# EAGLE schematic boardv2a (EAGLE 6.6.0), part 2 of 2
## Sheet 23 of 28: FPGA - Modular Connector E
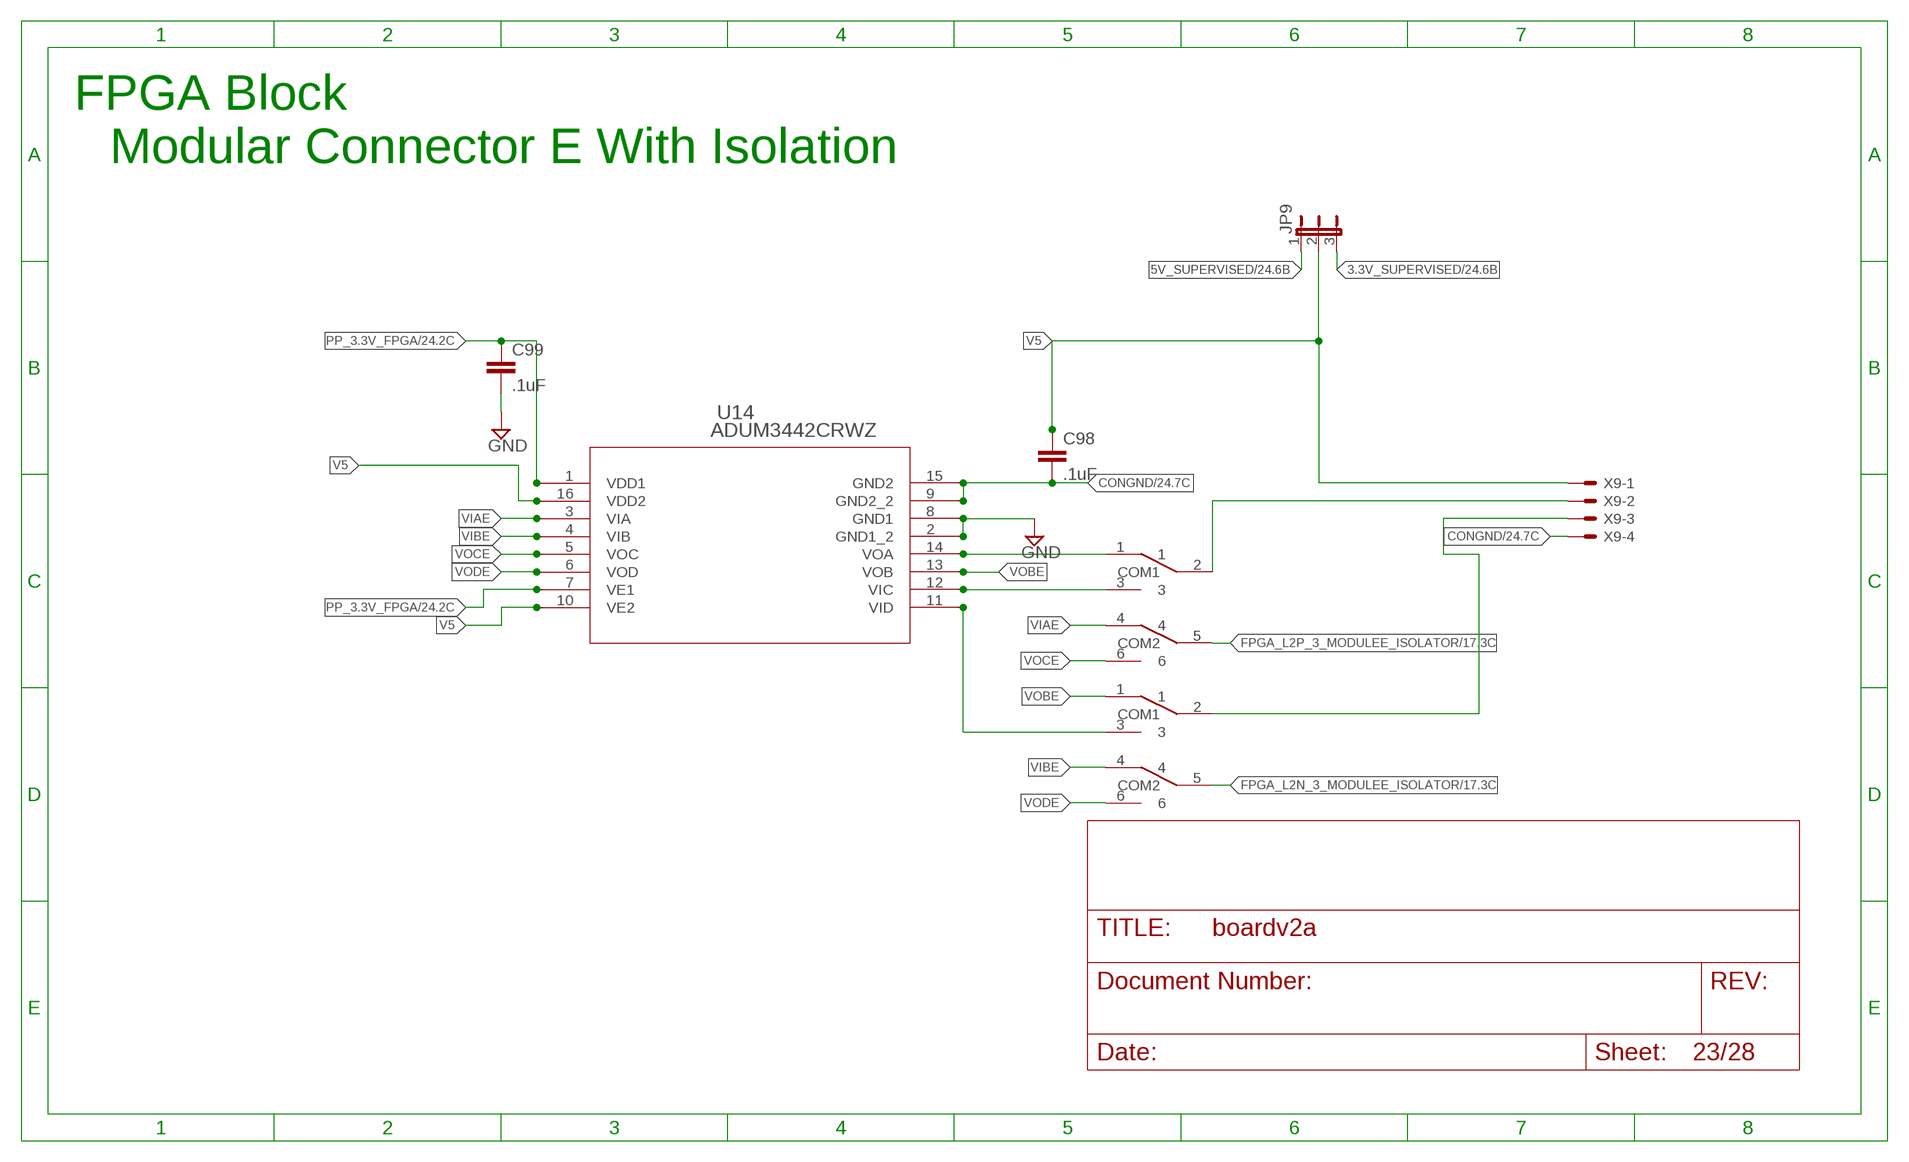
[diagram p24: schematic, sheet 23]

### Parts
C98  .1uF  CAP0603-CAP  [0603-CAP]
C99  .1uF  CAP0603-CAP  [0603-CAP]
JP9  JP2E  [JP2]
U14  ADUM3442CRWZ  [RW_16]
U$24  DPDTSWITCH  [JS202011]
U$25  DPDTSWITCH  [JS202011]
X9  KK-156-4  [KK-156-4]

### Nets
3.3V_SUPERVISED: JP9.3 ; also sheet 7,8,9,12,19,20,21,22,24,25,26
5V_SUPERVISED: JP9.1 ; also sheet 2,5,7,13,14,15,19,20,21,22,24,25,26
CONGND: C98.2 U14.9(GND2_2) U14.15(GND2) X9.4 ; also sheet 17,19,20,21,22,24,25,26
FPGA_L2N_3_MODULEE_ISOLATOR: U$24.5(COM2) ; also sheet 17
FPGA_L2P_3_MODULEE_ISOLATOR: U$25.5(COM2) ; also sheet 17
GND: C99.2 U14.2(GND1_2) U14.8(GND1) ; also sheet 2,3,4,5,6,7,8,9,12,13,14,15,17,18,19,20,21,22,24,25,26,28
N$94: U$25.2(COM1) X9.2
N$95: U$24.2(COM1) X9.3
N$96: U14.14(VOA) U$25.1
N$97: U14.12(VIC) U$25.3
N$98: U14.11(VID) U$24.3
PP_3.3V_FPGA: C99.1 U14.1(VDD1) U14.7(VE1) ; also sheet 17,19,20,21,22,24,25,26
V5: C98.1 JP9.2 U14.10(VE2) U14.16(VDD2) X9.1
VIAE: U14.3(VIA) U$25.4
VIBE: U14.4(VIB) U$24.4
VOBE: U14.13(VOB) U$24.1
VOCE: U14.5(VOC) U$25.6
VODE: U14.6(VOD) U$24.6

### Notes on the sheet
- FPGA Block
- Modular Connector E With Isolation

## Sheet 24 of 28: FPGA - Connector F
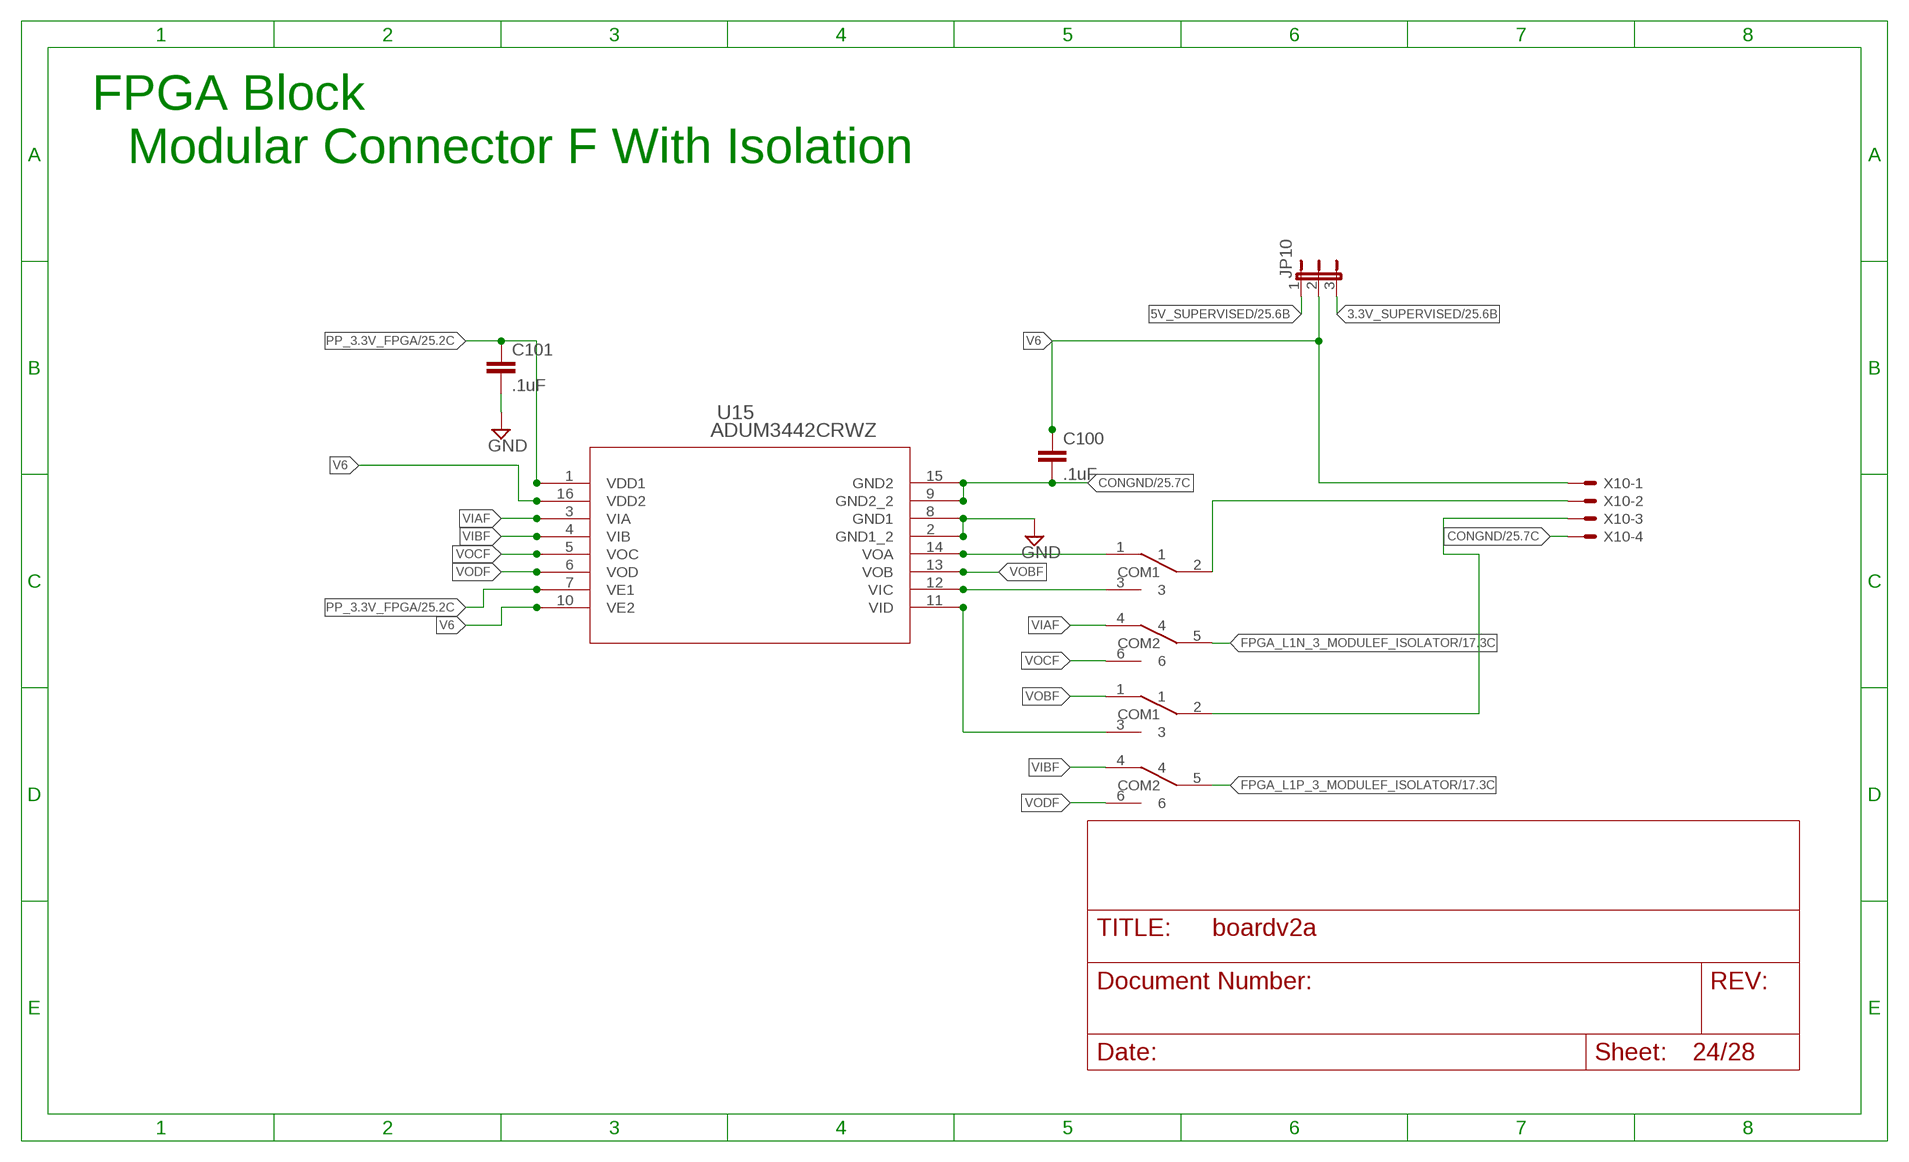
[diagram p25: schematic, sheet 24]

### Parts
C100  .1uF  CAP0603-CAP  [0603-CAP]
C101  .1uF  CAP0603-CAP  [0603-CAP]
JP10  JP2E  [JP2]
U15  ADUM3442CRWZ  [RW_16]
U$26  DPDTSWITCH  [JS202011]
U$27  DPDTSWITCH  [JS202011]
X10  KK-156-4  [KK-156-4]

### Nets
3.3V_SUPERVISED: JP10.3 ; also sheet 7,8,9,12,19,20,21,22,23,25,26
5V_SUPERVISED: JP10.1 ; also sheet 2,5,7,13,14,15,19,20,21,22,23,25,26
CONGND: C100.2 U15.9(GND2_2) U15.15(GND2) X10.4 ; also sheet 17,19,20,21,22,23,25,26
FPGA_L1N_3_MODULEF_ISOLATOR: U$27.5(COM2) ; also sheet 17
FPGA_L1P_3_MODULEF_ISOLATOR: U$26.5(COM2) ; also sheet 17
GND: C101.2 U15.2(GND1_2) U15.8(GND1) ; also sheet 2,3,4,5,6,7,8,9,12,13,14,15,17,18,19,20,21,22,23,25,26,28
N$99: U$27.2(COM1) X10.2
N$100: U$26.2(COM1) X10.3
N$101: U15.14(VOA) U$27.1
N$102: U15.12(VIC) U$27.3
N$103: U15.11(VID) U$26.3
PP_3.3V_FPGA: C101.1 U15.1(VDD1) U15.7(VE1) ; also sheet 17,19,20,21,22,23,25,26
V6: C100.1 JP10.2 U15.10(VE2) U15.16(VDD2) X10.1
VIAF: U15.3(VIA) U$27.4
VIBF: U15.4(VIB) U$26.4
VOBF: U15.13(VOB) U$26.1
VOCF: U15.5(VOC) U$27.6
VODF: U15.6(VOD) U$26.6

### Notes on the sheet
- FPGA Block
- Modular Connector F With Isolation

## Sheet 25 of 28: FPGA - Modular Connector G
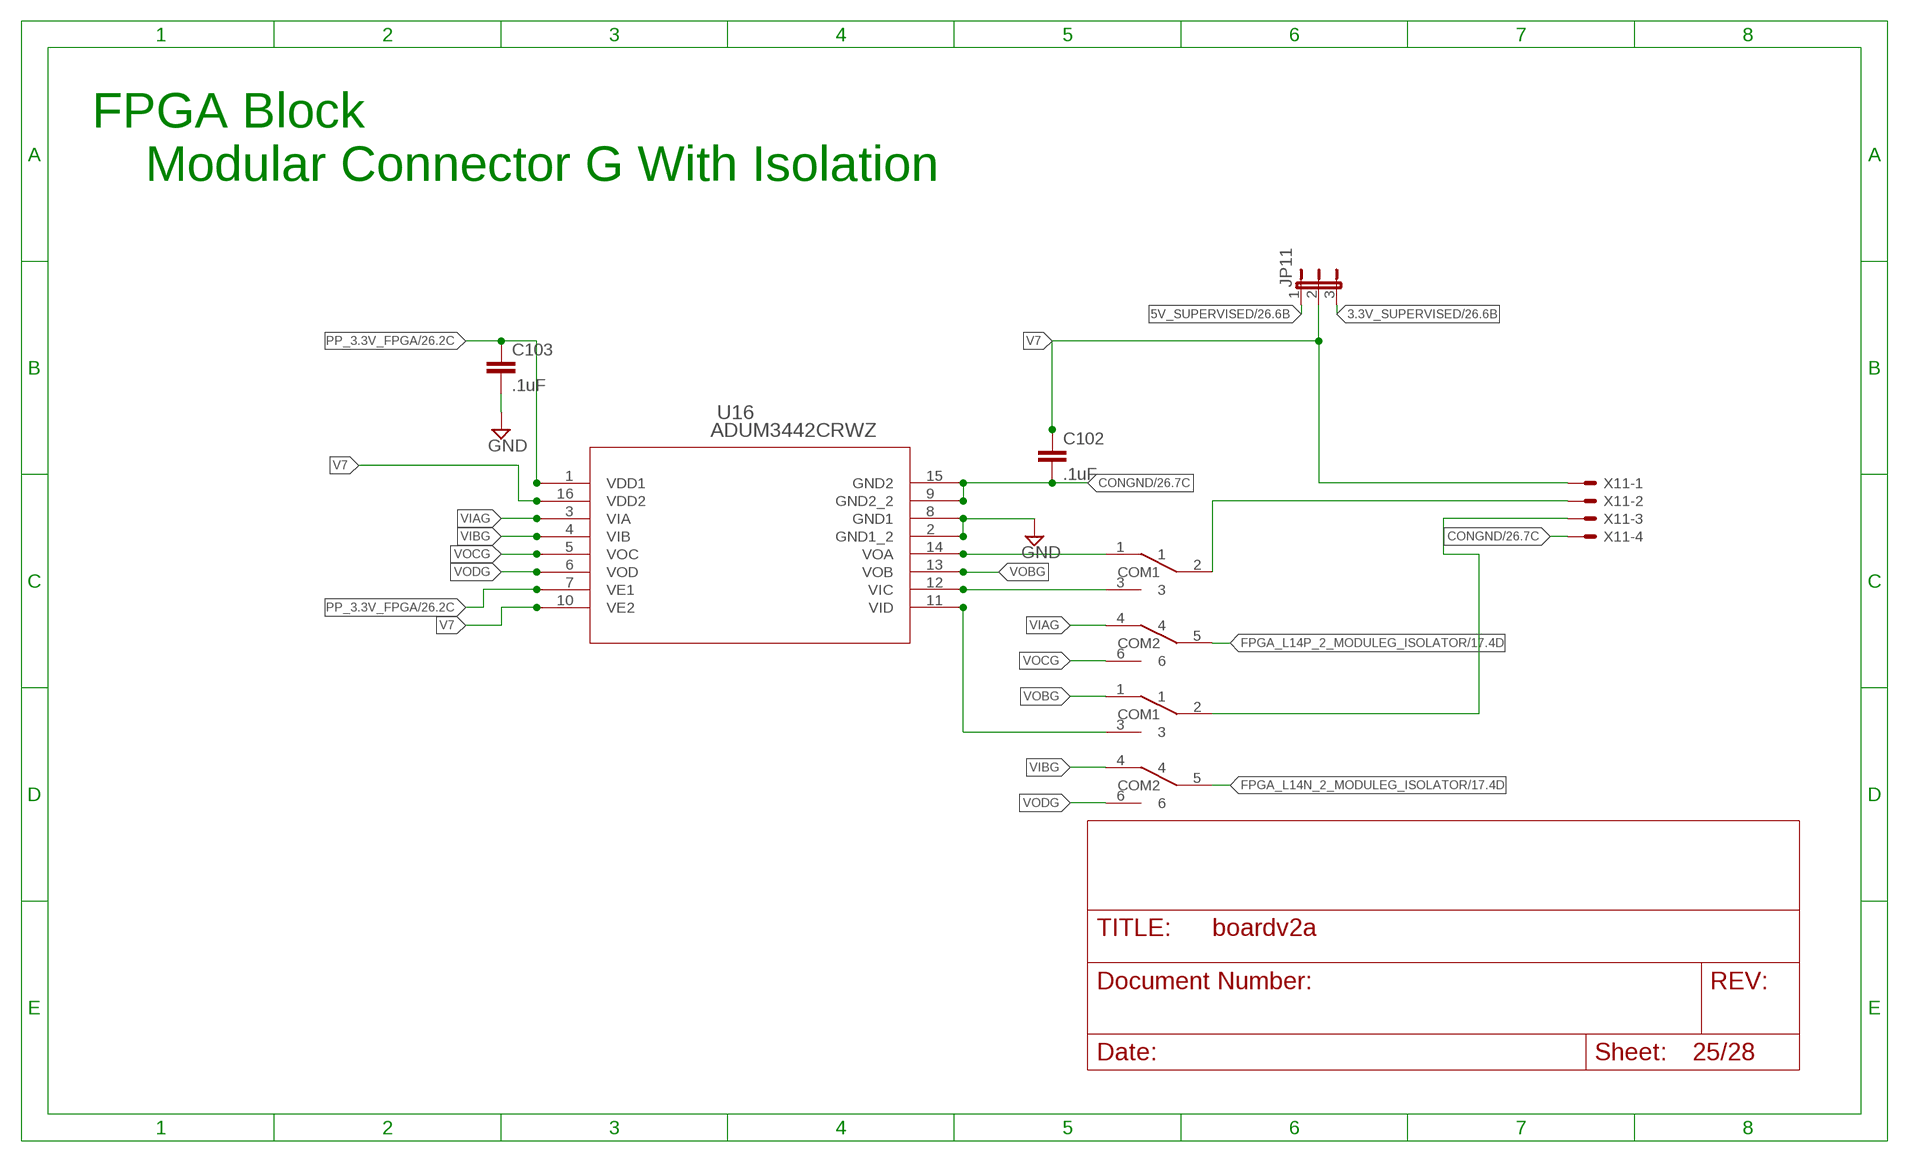
[diagram p26: schematic, sheet 25]

### Parts
C102  .1uF  CAP0603-CAP  [0603-CAP]
C103  .1uF  CAP0603-CAP  [0603-CAP]
JP11  JP2E  [JP2]
U16  ADUM3442CRWZ  [RW_16]
U$28  DPDTSWITCH  [JS202011]
U$29  DPDTSWITCH  [JS202011]
X11  KK-156-4  [KK-156-4]

### Nets
3.3V_SUPERVISED: JP11.3 ; also sheet 7,8,9,12,19,20,21,22,23,24,26
5V_SUPERVISED: JP11.1 ; also sheet 2,5,7,13,14,15,19,20,21,22,23,24,26
CONGND: C102.2 U16.9(GND2_2) U16.15(GND2) X11.4 ; also sheet 17,19,20,21,22,23,24,26
FPGA_L14N_2_MODULEG_ISOLATOR: U$28.5(COM2) ; also sheet 17
FPGA_L14P_2_MODULEG_ISOLATOR: U$29.5(COM2) ; also sheet 17
GND: C103.2 U16.2(GND1_2) U16.8(GND1) ; also sheet 2,3,4,5,6,7,8,9,12,13,14,15,17,18,19,20,21,22,23,24,26,28
N$104: U$29.2(COM1) X11.2
N$105: U$28.2(COM1) X11.3
N$106: U16.14(VOA) U$29.1
N$107: U16.12(VIC) U$29.3
N$108: U16.11(VID) U$28.3
PP_3.3V_FPGA: C103.1 U16.1(VDD1) U16.7(VE1) ; also sheet 17,19,20,21,22,23,24,26
V7: C102.1 JP11.2 U16.10(VE2) U16.16(VDD2) X11.1
VIAG: U16.3(VIA) U$29.4
VIBG: U16.4(VIB) U$28.4
VOBG: U16.13(VOB) U$28.1
VOCG: U16.5(VOC) U$29.6
VODG: U16.6(VOD) U$28.6

### Notes on the sheet
- FPGA Block
- Modular Connector G With Isolation

## Sheet 26 of 28: FPGA - Modular Conenctor H
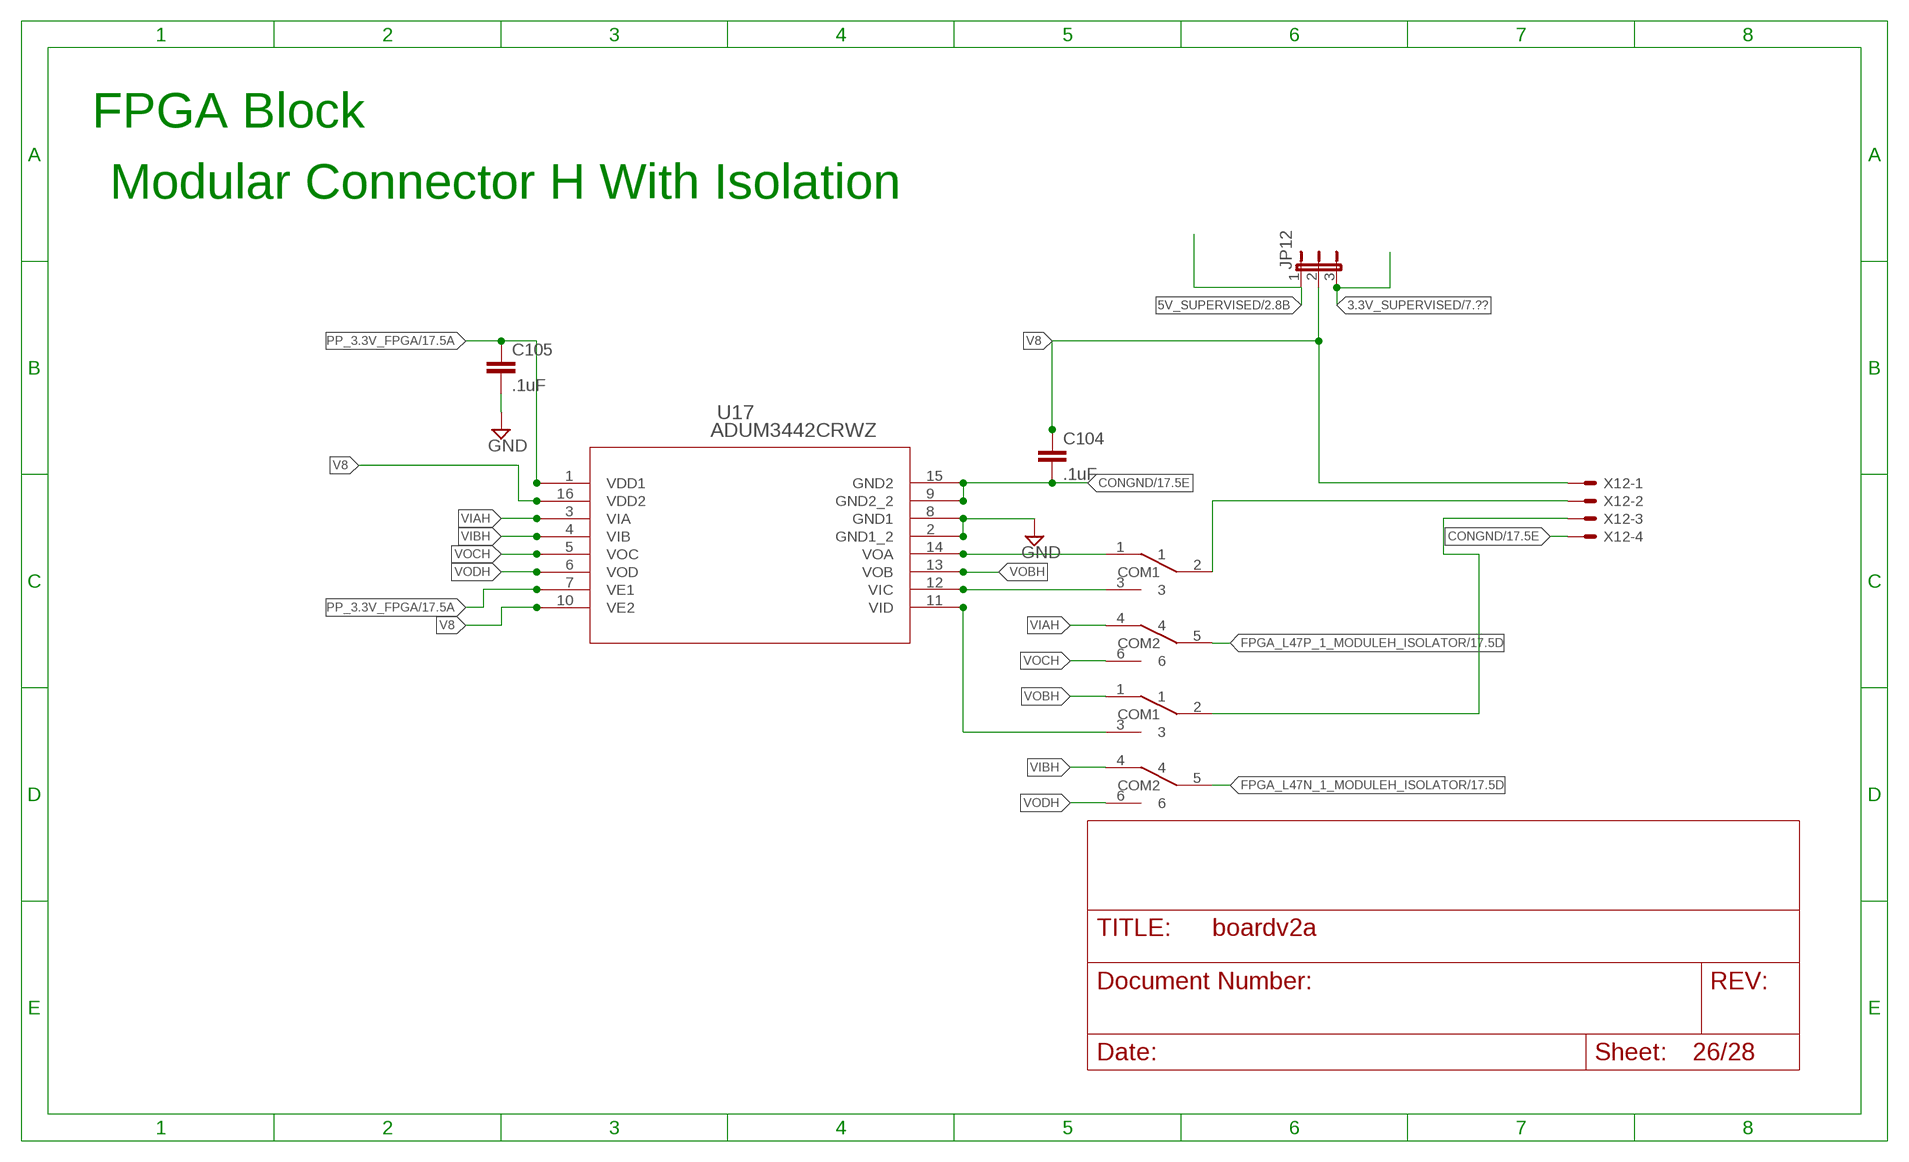
[diagram p27: schematic, sheet 26]

### Parts
C104  .1uF  CAP0603-CAP  [0603-CAP]
C105  .1uF  CAP0603-CAP  [0603-CAP]
JP12  JP2E  [JP2]
U17  ADUM3442CRWZ  [RW_16]
U$30  DPDTSWITCH  [JS202011]
U$31  DPDTSWITCH  [JS202011]
X12  KK-156-4  [KK-156-4]

### Nets
3.3V_SUPERVISED: JP12.3 ; also sheet 7,8,9,12,19,20,21,22,23,24,25
5V_SUPERVISED: JP12.1 ; also sheet 2,5,7,13,14,15,19,20,21,22,23,24,25
CONGND: C104.2 U17.9(GND2_2) U17.15(GND2) X12.4 ; also sheet 17,19,20,21,22,23,24,25
FPGA_L47N_1_MODULEH_ISOLATOR: U$30.5(COM2) ; also sheet 17
FPGA_L47P_1_MODULEH_ISOLATOR: U$31.5(COM2) ; also sheet 17
GND: C105.2 U17.2(GND1_2) U17.8(GND1) ; also sheet 2,3,4,5,6,7,8,9,12,13,14,15,17,18,19,20,21,22,23,24,25,28
N$109: U$31.2(COM1) X12.2
N$110: U$30.2(COM1) X12.3
N$111: U17.14(VOA) U$31.1
N$112: U17.12(VIC) U$31.3
N$113: U17.11(VID) U$30.3
PP_3.3V_FPGA: C105.1 U17.1(VDD1) U17.7(VE1) ; also sheet 17,19,20,21,22,23,24,25
V8: C104.1 JP12.2 U17.10(VE2) U17.16(VDD2) X12.1
VIAH: U17.3(VIA) U$31.4
VIBH: U17.4(VIB) U$30.4
VOBH: U17.13(VOB) U$30.1
VOCH: U17.5(VOC) U$31.6
VODH: U17.6(VOD) U$30.6

### Notes on the sheet
- FPGA Block
- Modular Connector H With Isolation

## Sheet 27 of 28: FPGA Connectors
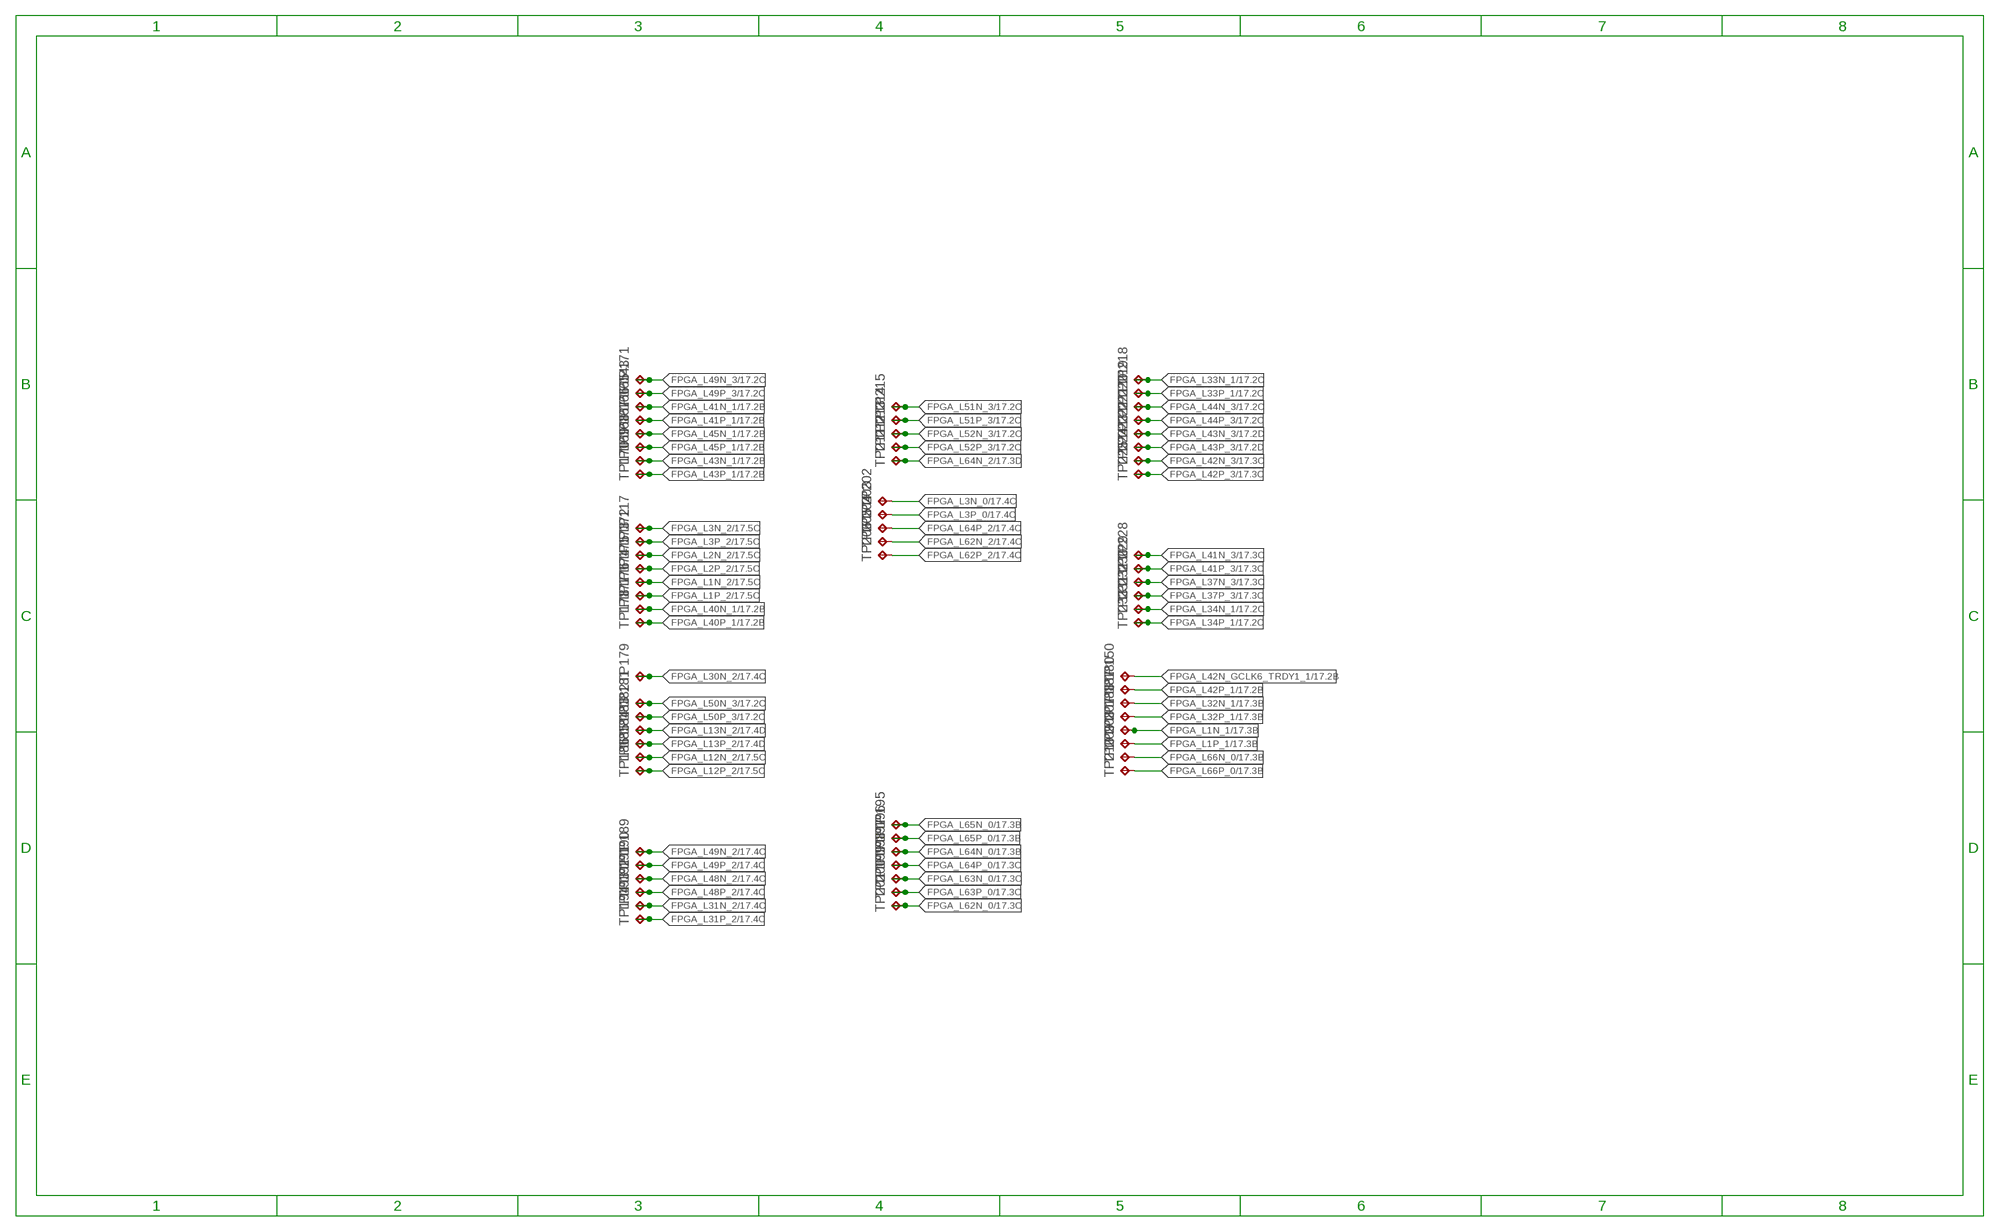
[diagram p28: schematic, sheet 27]

### Parts
TP117  TPPAD1-13  [P1-13]
TP143  TPPAD1-13  [P1-13]
TP150  TPPAD1-13  [P1-13]
TP165  TPPAD1-13  [P1-13]
TP166  TPPAD1-13  [P1-13]
TP167  TPPAD1-13  [P1-13]
TP168  TPPAD1-13  [P1-13]
TP169  TPPAD1-13  [P1-13]
TP170  TPPAD1-13  [P1-13]
TP171  TPPAD1-13  [P1-13]
TP172  TPPAD1-13  [P1-13]
TP173  TPPAD1-13  [P1-13]
TP174  TPPAD1-13  [P1-13]
TP175  TPPAD1-13  [P1-13]
TP176  TPPAD1-13  [P1-13]
TP177  TPPAD1-13  [P1-13]
TP178  TPPAD1-13  [P1-13]
TP179  TPPAD1-13  [P1-13]
TP180  TPPAD1-13  [P1-13]
TP181  TPPAD1-13  [P1-13]
TP182  TPPAD1-13  [P1-13]
TP183  TPPAD1-13  [P1-13]
TP184  TPPAD1-13  [P1-13]
TP185  TPPAD1-13  [P1-13]
TP186  TPPAD1-13  [P1-13]
TP187  TPPAD1-13  [P1-13]
TP188  TPPAD1-13  [P1-13]
TP189  TPPAD1-13  [P1-13]
TP190  TPPAD1-13  [P1-13]
TP191  TPPAD1-13  [P1-13]
TP192  TPPAD1-13  [P1-13]
TP193  TPPAD1-13  [P1-13]
TP194  TPPAD1-13  [P1-13]
TP195  TPPAD1-13  [P1-13]
TP196  TPPAD1-13  [P1-13]
TP197  TPPAD1-13  [P1-13]
TP198  TPPAD1-13  [P1-13]
TP199  TPPAD1-13  [P1-13]
TP200  TPPAD1-13  [P1-13]
TP201  TPPAD1-13  [P1-13]
TP202  TPPAD1-13  [P1-13]
TP203  TPPAD1-13  [P1-13]
TP204  TPPAD1-13  [P1-13]
TP205  TPPAD1-13  [P1-13]
TP206  TPPAD1-13  [P1-13]
TP207  TPPAD1-13  [P1-13]
TP208  TPPAD1-13  [P1-13]
TP209  TPPAD1-13  [P1-13]
TP210  TPPAD1-13  [P1-13]
TP211  TPPAD1-13  [P1-13]
TP212  TPPAD1-13  [P1-13]
TP213  TPPAD1-13  [P1-13]
TP214  TPPAD1-13  [P1-13]
TP215  TPPAD1-13  [P1-13]
TP218  TPPAD1-13  [P1-13]
TP219  TPPAD1-13  [P1-13]
TP220  TPPAD1-13  [P1-13]
TP221  TPPAD1-13  [P1-13]
TP222  TPPAD1-13  [P1-13]
TP223  TPPAD1-13  [P1-13]
TP224  TPPAD1-13  [P1-13]
TP225  TPPAD1-13  [P1-13]
TP228  TPPAD1-13  [P1-13]
TP229  TPPAD1-13  [P1-13]
TP230  TPPAD1-13  [P1-13]
TP231  TPPAD1-13  [P1-13]
TP232  TPPAD1-13  [P1-13]
TP233  TPPAD1-13  [P1-13]

### Nets
FPGA_L1N_1: TP207.TP ; also sheet 17
FPGA_L1N_2: TP174.TP ; also sheet 17
FPGA_L1P_1: TP208.TP ; also sheet 17
FPGA_L1P_2: TP176.TP ; also sheet 17
FPGA_L2N_2: TP173.TP ; also sheet 17
FPGA_L2P_2: TP175.TP ; also sheet 17
FPGA_L3N_0: TP202.TP ; also sheet 17
FPGA_L3N_2: TP117.TP ; also sheet 17
FPGA_L3P_0: TP203.TP ; also sheet 17
FPGA_L3P_2: TP172.TP ; also sheet 17
FPGA_L12N_2: TP185.TP ; also sheet 17
FPGA_L12P_2: TP186.TP ; also sheet 17
FPGA_L13N_2: TP183.TP ; also sheet 17
FPGA_L13P_2: TP184.TP ; also sheet 17
FPGA_L30N_2: TP179.TP ; also sheet 17
FPGA_L31N_2: TP193.TP ; also sheet 17
FPGA_L31P_2: TP194.TP ; also sheet 17
FPGA_L32N_1: TP187.TP ; also sheet 17
FPGA_L32P_1: TP188.TP ; also sheet 17
FPGA_L33N_1: TP218.TP ; also sheet 17
FPGA_L33P_1: TP219.TP ; also sheet 17
FPGA_L34N_1: TP231.TP ; also sheet 17
FPGA_L34P_1: TP233.TP ; also sheet 17
FPGA_L37N_3: TP230.TP ; also sheet 17
FPGA_L37P_3: TP232.TP ; also sheet 17
FPGA_L40N_1: TP177.TP ; also sheet 17
FPGA_L40P_1: TP178.TP ; also sheet 17
FPGA_L41N_1: TP165.TP ; also sheet 17
FPGA_L41N_3: TP228.TP ; also sheet 17
FPGA_L41P_1: TP166.TP ; also sheet 17
FPGA_L41P_3: TP229.TP ; also sheet 17
FPGA_L42N_3: TP224.TP ; also sheet 17
FPGA_L42N_GCLK6_TRDY1_1: TP150.TP ; also sheet 17
FPGA_L42P_1: TP180.TP ; also sheet 17
FPGA_L42P_3: TP225.TP ; also sheet 17
FPGA_L43N_1: TP169.TP ; also sheet 17
FPGA_L43N_3: TP222.TP ; also sheet 17
FPGA_L43P_1: TP170.TP ; also sheet 17
FPGA_L43P_3: TP223.TP ; also sheet 17
FPGA_L44N_3: TP220.TP ; also sheet 17
FPGA_L44P_3: TP221.TP ; also sheet 17
FPGA_L45N_1: TP167.TP ; also sheet 17
FPGA_L45P_1: TP168.TP ; also sheet 17
FPGA_L48N_2: TP191.TP ; also sheet 17
FPGA_L48P_2: TP192.TP ; also sheet 17
FPGA_L49N_2: TP189.TP ; also sheet 17
FPGA_L49N_3: TP171.TP ; also sheet 17
FPGA_L49P_2: TP190.TP ; also sheet 17
FPGA_L49P_3: TP143.TP ; also sheet 17
FPGA_L50N_3: TP181.TP ; also sheet 17
FPGA_L50P_3: TP182.TP ; also sheet 17
FPGA_L51N_3: TP215.TP ; also sheet 17
FPGA_L51P_3: TP214.TP ; also sheet 17
FPGA_L52N_3: TP213.TP ; also sheet 17
FPGA_L52P_3: TP212.TP ; also sheet 17
FPGA_L62N_0: TP201.TP ; also sheet 17
FPGA_L62N_2: TP205.TP ; also sheet 17
FPGA_L62P_2: TP206.TP ; also sheet 17
FPGA_L63N_0: TP199.TP ; also sheet 17
FPGA_L63P_0: TP200.TP ; also sheet 17
FPGA_L64N_0: TP197.TP ; also sheet 17
FPGA_L64N_2: TP211.TP ; also sheet 17
FPGA_L64P_0: TP198.TP ; also sheet 17
FPGA_L64P_2: TP204.TP ; also sheet 17
FPGA_L65N_0: TP195.TP ; also sheet 17
FPGA_L65P_0: TP196.TP ; also sheet 17
FPGA_L66N_0: TP209.TP ; also sheet 17
FPGA_L66P_0: TP210.TP ; also sheet 17

## Sheet 28 of 28
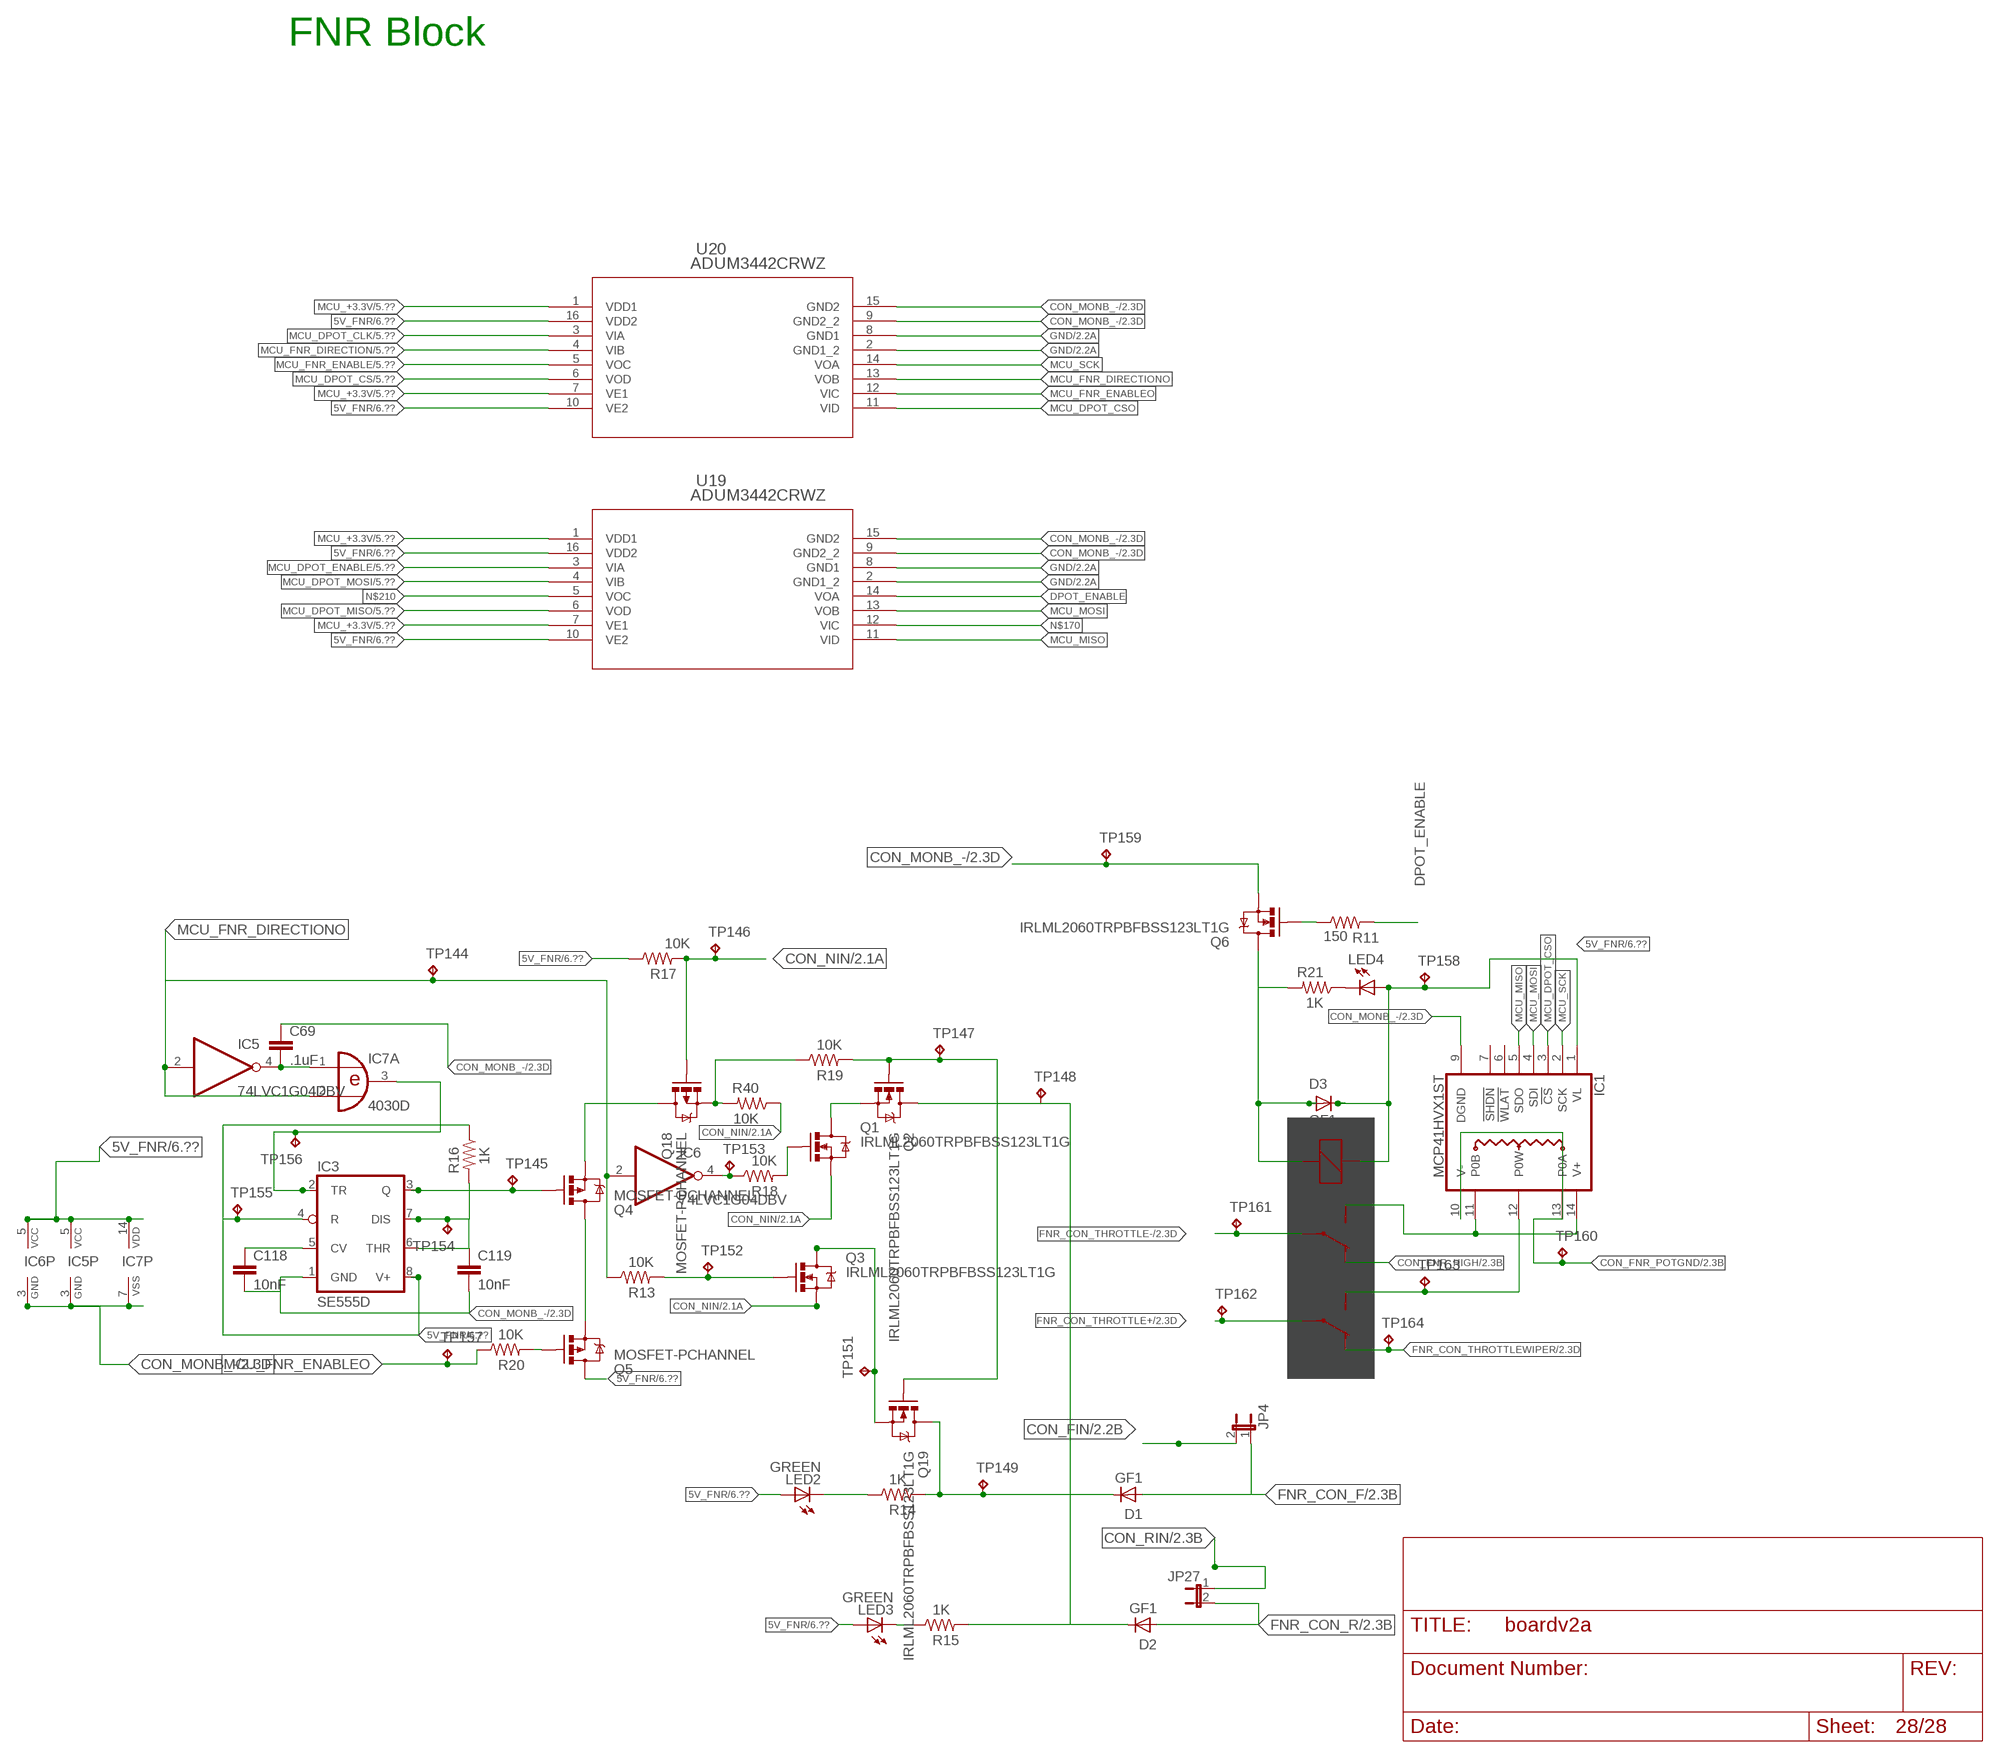
[diagram p29: schematic, sheet 28]

### Parts
C69  .1uF  CAP0603-CAP  [0603-CAP]
C118  10nF  CAP0603-CAP  [0603-CAP]
C119  10nF  CAP0603-CAP  [0603-CAP]
D1  GF1  [SMA-DO214AC]
D2  GF1  [SMA-DO214AC]
D3  GF1  [SMA-DO214AC]
IC1  MCP41HVX1ST  [TSSOP14]
IC3  SE555D  [SO08]
IC5  74LVC1G04DBV  [SOT23-5]
IC6  74LVC1G04DBV  [SOT23-5]
IC7  4030D  [SO14]
JP4  JP1E  [JP1]
JP27  JP1E  [JP1]
K1  G5V-2  [G5V-2]
LED2  GREEN  LEDSMT1206  [1206]
LED3  GREEN  LEDSMT1206  [1206]
LED4  LEDCHIPLED_1206  [CHIPLED_1206]
Q1  IRLML2060TRPBFBSS123LT1G  [SOT23-3]
Q2  IRLML2060TRPBFBSS123LT1G  [SOT23-3]
Q3  IRLML2060TRPBFBSS123LT1G  [SOT23-3]
Q4  MOSFET-PCHANNEL  [SOT23-3]
Q5  MOSFET-PCHANNEL  [SOT23-3]
Q6  IRLML2060TRPBFBSS123LT1G  [SOT23-3]
Q18  MOSFET-PCHANNEL  [SOT23-3]
Q19  IRLML2060TRPBFBSS123LT1G  [SOT23-3]
R11  150  R-US_R0603  [R0603]
R13  10K  R-US_R0603  [R0603]
R14  1K  R-US_MELF0102W  [MINI_MELF-0102W]
R15  1K  R-US_R0603  [R0603]
R16  1K  R-US_R0603  [R0603]
R17  10K  R-US_R0603  [R0603]
R18  10K  R-US_R0603  [R0603]
R19  10K  R-US_R0603  [R0603]
R20  10K  R-US_R0603  [R0603]
R21  1K  R-US_R0603  [R0603]
R40  10K  R-US_R0603  [R0603]
TP144  TPB1,27  [B1,27]
TP145  TPB1,27  [B1,27]
TP146  TPB1,27  [B1,27]
TP147  TPB1,27  [B1,27]
TP148  TPB1,27  [B1,27]
TP149  TPB1,27  [B1,27]
TP151  TPB1,27  [B1,27]
TP152  TPB1,27  [B1,27]
TP153  TPB1,27  [B1,27]
TP154  TPB1,27  [B1,27]
TP155  TPB1,27  [B1,27]
TP156  TPB1,27  [B1,27]
TP157  TPB1,27  [B1,27]
TP158  TPB1,27  [B1,27]
TP159  TPB1,27  [B1,27]
TP160  TPB1,27  [B1,27]
TP161  TPB1,27  [B1,27]
TP162  TPB1,27  [B1,27]
TP163  TPB1,27  [B1,27]
TP164  TPB1,27  [B1,27]
U19  ADUM3442CRWZ  [RW_16]
U20  ADUM3442CRWZ  [RW_16]

### Nets
5V_FNR: D3.K(C) IC1.1(VL) IC3.4(R) IC3.8(V+) IC5.5(VCC) IC6.5(VCC) IC7.14(P:VDD) K1.1 LED2.A LED3.A LED4.A Q5.3(D) R16.1 R17.1 TP155.TP TP158.TP U19.10(VE2) U19.16(VDD2) U20.10(VE2) U20.16(VDD2) ; also sheet 6
CON_FIN: JP4.2 ; also sheet 2
CON_FNR_HIGH: K1.11(2:O) ; also sheet 2
CON_FNR_POTGND: IC1.10(V-) IC1.13(P0A) TP160.TP ; also sheet 2
CON_MONB_-: C69.1 C118.2 C119.2 IC1.9(DGND) IC3.1(GND) IC5.3(GND) IC6.3(GND) IC7.7(P:VSS) Q6.2(S) TP159.TP U19.9(GND2_2) U19.15(GND2) U20.9(GND2_2) U20.15(GND2) ; also sheet 2,6,14
CON_NIN: Q1.2(S) Q3.2(S) Q18.1(G) R17.2 R40.1 TP146.TP ; also sheet 2
CON_RIN: JP27.1 ; also sheet 2
DPOT_ENABLE: R11.2 U19.14(VOA)
FNR_CON_F: D1.A JP4.1 ; also sheet 2
FNR_CON_FD: D1.K(C) Q19.3(D) R14.2 TP149.TP
FNR_CON_R: D2.A JP27.2 ; also sheet 2
FNR_CON_RD: D2.K(C) Q2.3(D) R15.2 TP148.TP
FNR_CON_THROTTLE+: K1.4(1:P) TP162.TP ; also sheet 2
FNR_CON_THROTTLE-: K1.13(2:P) TP161.TP ; also sheet 2
FNR_CON_THROTTLEWIPER: K1.6(1:O) TP164.TP ; also sheet 2
GND: U19.2(GND1_2) U19.8(GND1) U20.2(GND1_2) U20.8(GND1) ; also sheet 2,3,4,5,6,7,8,9,12,13,14,15,17,18,19,20,21,22,23,24,25,26
MCU_+3.3V: U19.1(VDD1) U19.7(VE1) U20.1(VDD1) U20.7(VE1) ; also sheet 5,8,11,16
MCU_DPOT_CLK: U20.3(VIA) ; also sheet 5
MCU_DPOT_CS: U20.6(VOD) ; also sheet 5
MCU_DPOT_CSO: IC1.3(!CS) U20.11(VID)
MCU_DPOT_ENABLE: U19.3(VIA) ; also sheet 5
MCU_DPOT_MISO: U19.6(VOD) ; also sheet 5
MCU_DPOT_MOSI: U19.4(VIB) ; also sheet 5
MCU_FNR_DIRECTION: U20.4(VIB) ; also sheet 5
MCU_FNR_DIRECTIONO: IC5.2(I) IC6.2(I) IC7.2(A:I1) R13.1 TP144.TP U20.13(VOB)
MCU_FNR_ENABLE: U20.5(VOC) ; also sheet 5
MCU_FNR_ENABLEO: R20.1 TP157.TP U20.12(VIC)
MCU_MISO: IC1.5(SDO) U19.11(VID)
MCU_MOSI: IC1.4(SDI) U19.13(VOB)
MCU_SCK: IC1.2(SCK) U20.14(VOA)
N$33: Q5.1(G) R20.2
N$49: IC1.12(P0W) K1.8(1:S) TP163.TP
N$50: LED4.C R21.1
N$51: IC1.11(P0B) IC1.14(V+) K1.9(2:S)
N$55: Q6.1(G) R11.1
N$56: LED2.C R14.1
N$57: D3.A K1.16 Q6.3(D) R21.2
N$58: LED3.C R15.1
N$59: C119.1 IC3.6(THR) IC3.7(DIS) R16.2 TP154.TP
N$60: C69.2 IC5.4(O) IC7.1(A:I0)
N$61: IC3.2(TR) IC7.3(A:O) TP156.TP
N$62: IC3.3(Q) Q4.1(G) TP145.TP
N$130: Q4.3(D) Q5.2(S)
N$131: IC6.4(O) R18.1 TP153.TP
N$132: Q4.2(S) Q18.3(D)
N$135: Q1.1(G) R18.2
N$136: Q3.1(G) R13.2 TP152.TP
N$138: Q18.2(S) R19.1 R40.2
N$139: Q1.3(D) Q2.2(S)
N$141: Q3.3(D) Q19.2(S) TP151.TP
N$142: Q2.1(G) Q19.1(G) R19.2 TP147.TP
N$147: C118.1 IC3.5(CV)
N$170: U19.12(VIC)
N$210: U19.5(VOC)
Unconnected: IC1.6(!WLAT) IC1.7(!SHDN) IC7.4(B:O) IC7.5(B:I0) IC7.6(B:I1) IC7.8(C:I0) IC7.9(C:I1) IC7.10(C:O) IC7.11(D:O) IC7.12(D:I0) IC7.13(D:I1)

### Notes on the sheet
- FNR Block

## Library data of the parts
24OHM 24OHMS 24OHMS1 24OHMS3 R1-R10 R12 R22-R39 R41 R42 R59-R78 R82-R90 R92 R94-R99 R103-R111 R113 R114 RES604 = SparkFun-Passives:RESISTOR: Resistor Basic schematic elements and footprints for 0603, 1206, and PTH resistors.
C1-C16 C38-C45 C56-C68 C70-C85 C106-C113 C116 C117 = eagle-ltspice:C: CAPACITOR, European symbol; SPICEMODEL: NONE; SPICEPREFIX: C
C17 C18 C21-C37 C69 C88-C105 C118 C119 = SparkFun-Capacitors:CAP: Capacitor Standard 0603 ceramic capacitor, and 0.1" leaded capacitor.
C46-C55 C86 C87 C114 C115 = rcl:C-EU: CAPACITOR, European symbol
D1-D3 = diode:GF1: DIODE
IC1 = microchip-mcp41hvx1:MCP41HVX1: The MCP45HVX1 family of devices have dual power rails (analog and digital). The analog power rail allows high voltage on the resistor network terminal pins. The analog voltage range is determined by the V+ and V– voltages. The library has been designed by Richard Magdycz <https://www.facebook.com/groups/eaglecadsoftUK>
IC2 = kblom:ADUM4160: Full/Low Speed 5 kV USB Digital Isolator Applications: USB peripheral isolation Isolated USB hub Medical applications source <http://www.analog.com/static/imported-files/data_sheets/ADuM4160.pdf> iso; FARNELL: 1858056
IC3 = linear:*555: TIMER
IC5 IC6 = 74xx-little-us:74*1G04: INVERTER Gate
IC7 = 40xx:4030: Quad XOR
J1-J3 = con-lsta:JU05: PIN HEADER; OC_FARNELL: unknown; OC_NEWARK: unknown
JP1-JP4 JP13-JP18 JP21 JP23 JP25 JP27-JP30 JP48 = jumper:JP1E: JUMPER
JP5-JP12 JP22 JP24 JP26 JP97-JP102 JP111 = jumper:JP2E: JUMPER
JP19 JP20 JP49 JP51-JP53 JP69 JP82-JP88 JP96 = jumper:JP1Q: JUMPER
JP81 = SparkFun-Connectors:USB: USB Connectors USB-B-PTH is fully proven SKU : PRT-00139/CONN-08278 USB-miniB is fully proven SKU : PRT-00587 USB-A-PCB is untested. USB-A-H is throughly reviewed, but untested. Spark Fun Electronics SKU : PRT-00437 USB-B-SMT is throughly reviewed, but untested. Needs silkscreen touching up. USB-A-S has not been used/tested USB-MB-H has not been used/tested USB-MICROB has been used. CONN-09505; PROD_ID: CONN-08278
K1 = relay:G5V-2: OMRON PCB Relay Source: http://www.omron.com/ecb/products/pdf/en-g5v2.pdf; MPN: G5V-2 5DC; OC_FARNELL: 9949488; OC_NEWARK: 78K5703
K2 = relay:CP1?-*: ULTRA-MINIATURE LOW PROFILE AUTOMOTIVE RELAY NAiS Source: http://www.mew-europe.com/.. en_ds_61207_0000.pdf; MPN: CP1SA-12V-X; OC_FARNELL: unknown; OC_NEWARK: 96K2384
L1-L7 = inductors:BLM15H: EMIFIL (R) Chip Ferrite Bead for GHz Noise Source: http://www.murata.com/ Ferrite Bead BLM15H.pdf
LED2-LED4 = adafruit:LED: LED
LED5 LED23 LED24 = eagle-ltspice:LED_E: LED Source: http://www.osram.convergy.de Source: www.luxeon.com Source: www.kingbright.com; SPICEMODEL: NONE; SPICEPREFIX: D; SPICETYPE: diode
LED6-LED8 LED10-LED20 LED26 = led:LED: LED
PTC PTC1 = resistor:R-US_: RESISTOR, American symbol
Q1-Q3 Q6 Q8-Q13 Q17 Q19 = SparkFun-DiscreteSemi:IRLML2060TRPBF: Common NMOSFET Parts MFG P/N Store ID Prod ID FDD8780 TRANS-09984 SI7820DN TRANS-11055 FDS6630A IC-08089 2N7002PW TRANS-11151 FQP30N06L COM-10213 TRANS-10060 BSS123LT1G TRANS-08345 BSS138 TRANS-00830 BS170 2N7000; PROD_ID: TRANS-08345
Q4 Q5 Q18 = SparkFun-DiscreteSemi:MOSFET-PCHANNEL: Generic PMOSFET IRLML2244 - TRANS-11153 (SOT-23 -20V -4.3A) (1.Gate 2.Source 3.Drain) FQP27P06 - COM-10349 <http://www.sparkfun.com/products/10349> (TO-220 -60V -27A) (1.Gate 2.Source 3.Drain); PROD_ID: TRANS-08285
Q7 = crystal:ASF*: CRYSTAL CLOCK OSCILLATORS 5.0 Vdc or 3.3 Vdc - LOW PROFILE ULTRA MINIATURE CERAMIC SURFACE MOUNT Source: http://www.abracon.com/Oscillators/asf1-L-L1.pdf; MF: Abracon Corporation; MPN: ASFL1-125.000MHZ-EC-T; OC_FARNELL: 1838931; OC_NEWARK: 19M1882
R11 R13-R21 R40 R2401-R2405 = rcl:R-US_: RESISTOR, American symbol
SV1 SV2 = con-lsta:FE05-1: FEMALE HEADER; OC_FARNELL: unknown; OC_NEWARK: unknown
SV3-SV5 = con-lstb:MA03-2: PIN HEADER; OC_FARNELL: unknown; OC_NEWARK: unknown
TP1-TP225 TP228-TP233 = testpad:TP: Test pad
U1 = shit:CP2130-GM; MANUFACTURER_PART_NUMBER: cp2130-gm; VENDOR: Silicon Labs
U2 = version2:TMS570LS0432_PZ_100; MANUFACTURER_PART_NUMBER: tms570ls0432_pz_100; VENDOR: TEXAS INSTRUMENTS
U3 U4 U7 U18 = shit:LM1085_KTT_3; MANUFACTURER_PART_NUMBER: lm1085_ktt_3; VENDOR: Texas Instruments
U5 = shit:LM1084_KTT_3; BASE_PN: LM1084; COMP: TypeLDO; LIBRARY: ReferenceLM1084IS; PARTNUMBER: LM1084IS-33; PIN: Count3; SYMBOL: NameLM1084IS-33; TYPE: LM1084IS-3.3; VENDOR: NationalSemiconductor; VERSION: 1
U6 = shit:TPS3514_D_14; DATASHEETURL: http://www.ti.com/lit/gpn/TPS3514; DESCRIPTION: 3 Ch Supervisor with Over Current Detect for Switchmode Power Supplies; FAMILY_NAME: SUPERVISOR AND RESET IC; GENERIC_PART_NUMBER: TPS3514; INDUSTRY_STD_PKG_TYPE: SOIC; MANUFACTURER: Texas Instruments; MANUFACTURER_PART_NUMBER: tps3514_d_14; PACKAGE_DESIGNATOR: D; PIN_COUNT: 14; VENDOR: Texas Instruments
U8 = SparkFun-DigitalIC:W5100: WIZnet W5100 TCP/IP PHY Embedded Chip See SparkFun catalog # COM-09471 Package: LQFP-80,10x10mm, 0.4mm pitch
U9 U11-U17 U19 U20 = digital-isolator:ADUM3442CRWZ
U10 = shit:SN65HVDA100-Q1_D_8; DATASHEETURL: http://www.ti.com/lit/gpn/SN65HVDA100-Q1; DESCRIPTION: LIN Physical Interface; FAMILY_NAME: LIN TRANSCEIVER; GENERIC_PART_NUMBER: SN65HVDA100-Q1; INDUSTRY_STD_PKG_TYPE: SOIC; MANUFACTURER: Texas Instruments; MANUFACTURER_PART_NUMBER: sn65hvda100-q1_d_8; PACKAGE_DESIGNATOR: D; PIN_COUNT: 8; VENDOR: Texas Instruments
U$1-U$3 = freescalemod:MM912_637D1
U$4 U$32 = shit:RHM1620CT-ND
U$5 = connectors:34830-2001
U$6 = xilinx_devices_V6:XC6SLX4-2TQG144C
U$7 = connectors:JTAG14PIN
U$8 = shit:RFCMF1220100M3T
U$9 = connectors:JTAG20PIN
U$10 U$12 = shit:LM25061_DGS_10; MANUFACTURER_PART_NUMBER: lm25061pmm-1nopb; VENDOR: National
U$11 U$33 = shit:1.2VREG
U$13 U$14 U$16-U$20 U$23-U$31 = shit:DPDTSWITCH
U$15 U$21 = version2:7A-16.000MAAJ-T
U$22 = shit:ETHERNET_CONNECTOR
X1-X3 = con-molex:KK-156-2: KK 156 HEADER Source: http://www.molex.com/pdm_docs/sd/026604100_sd.pdf; OC_FARNELL: unknown; OC_NEWARK: unknown
X4 = con-molex:5566-4: Mini FIT connector 4 pol Source: http://www.molex.com; OC_FARNELL: unknown; OC_NEWARK: unknown
X5-X12 = con-molex:KK-156-4: KK 156 HEADER Source: http://www.molex.com/pdm_docs/sd/026604100_sd.pdf; OC_FARNELL: unknown; OC_NEWARK: unknown

## Net classes
0 default: width 0.203 mm, drill 0.254 mm, clearance 0.102 mm